# Altium schematic sheet ch32v003f4p6.SchDoc
size A
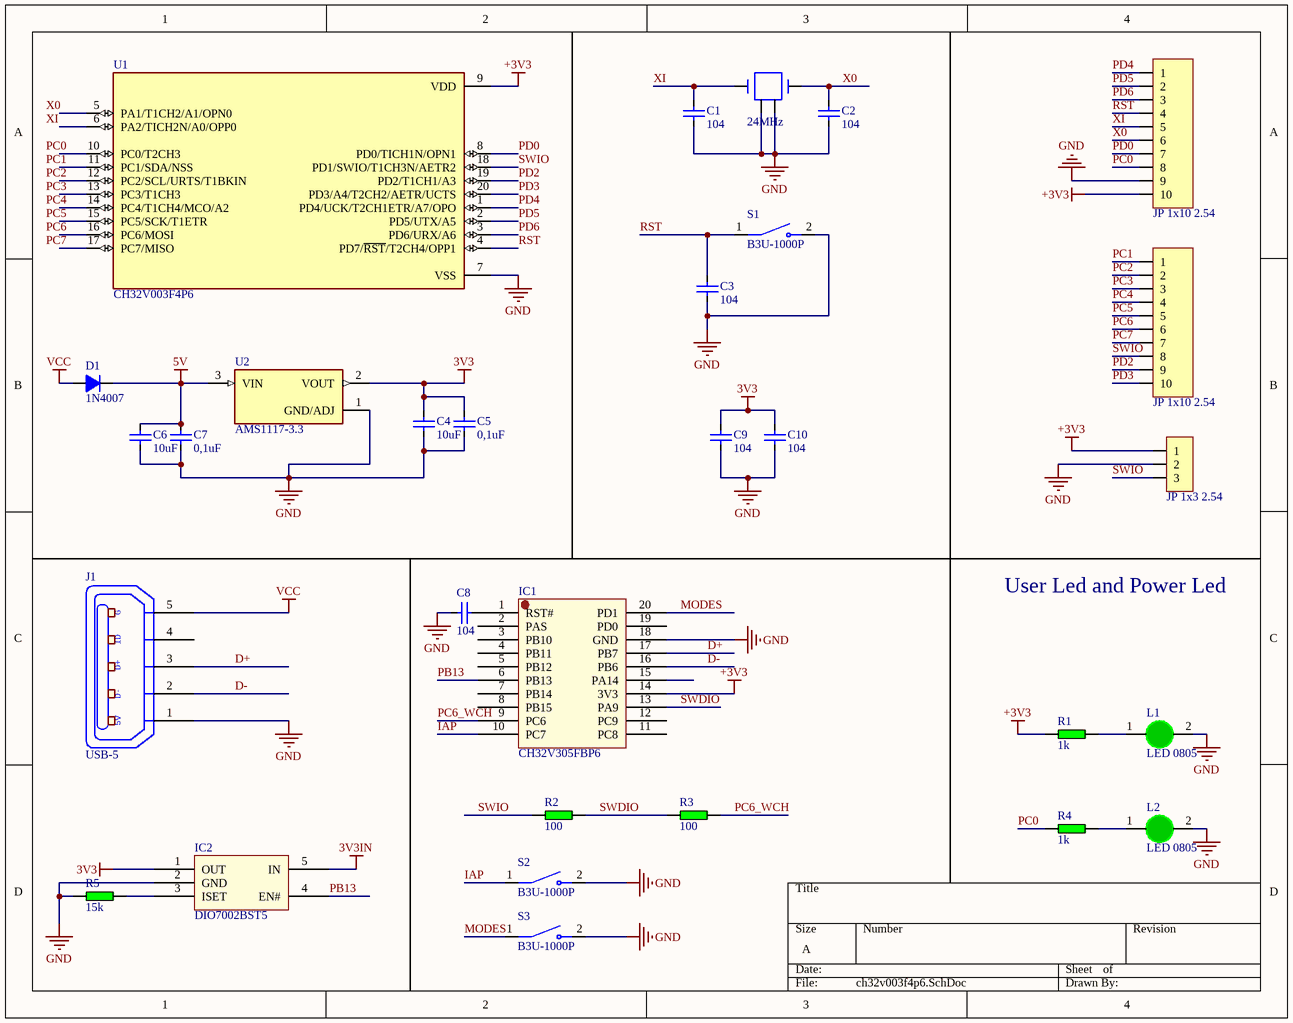
[diagram p0: ch32v003f4p6.SchDoc]

## Parts
C1  104  [CAP_0603]
C2  104  [CAP_0603]
C3  104  [CAP_0603]
C4  10uF  [CAP_0603]
C5  0,1uF  [CAP_0603]
C6  10uF  [CAP_0603]
C7  0,1uF  [CAP_0603]
C8  104  [CAP_0603]
C9  104  [CAP_0603]
C10  104  [CAP_0603]
D1  1N4007  [DIO-214AC(SMA)]
IC1  CH32V305FBP6  [TSSOP-20]
IC2  DIO7002BST5  [SOT23-5]
J1  USB-5  [USB-M1]
JP1  JP 1x10 2.54  [JP 1x10 DT]
JP2  JP 1x10 2.54  [JP 1x10 DT]
JP3  JP 1x3 2.54  [JP 1x3 DC]
L1  LED 0805  [LED-0805-Green]
L2  LED 0805  [LED-0805-Green]
R1  1k  [RES-SMD-0603]
R2  100  [RES-SMD-0603]
R3  100  [RES-SMD-0603]
R4  1k  [RES-SMD-0603]
R5  15k  [RES-SMD-0603]
S1  B3U-1000P  [SW_B3U-1000P]
S2  B3U-1000P  [SW_B3U-1000P]
S3  B3U-1000P  [SW_B3U-1000P]
U1  CH32V003F4P6  [SOP65P640X121-20N]
U2  AMS1117-3.3  [SOT229P700X180-4N]
Y1  24MHz  [Crystal 4 pin SMD 50x32]

## Nets
3V3: C4.2 C5.2 C9.2 C10.2 IC2.1(OUT) U2.2(VOUT)
3V3IN: IC2.5(IN)
5V: C6.2 C7.2 D1.2(K) U2.3(VIN)
+3V3: IC1.14(3V3) JP1.10 JP3.1 R1.2 U1.9(VDD)
GND: C1.1 C2.1 C3.1 C4.1 C5.1 C6.1 C7.1 C8.1 C9.1 C10.1 IC1.18(GND) IC2.2(GND) J1.1(P1) JP1.9 JP3.2 L1.2(K) L2.2(K) R5.2 S1.2 S2.2 S3.2 U1.7(VSS) U2.1(GND/ADJ) Y1.2(GND) Y1.4(GND)
VCC: D1.1(A) J1.5(P5)
D+: IC1.17(PB7) J1.3(P3)
D-: IC1.16(PB6) J1.2(P2)
IAP: IC1.10(PC7) S2.1
MODES: IC1.20(PD1) S3.1
PB13: IC1.6(PB13) IC2.4(EN#)
PC0: JP1.8 R4.2
PC1: JP2.1
PC2: JP2.2
PC3: JP2.3
PC4: JP2.4
PC5: JP2.5
PC6: JP2.6
PC6_WCH: IC1.9(PC6) R3.1
PC7: JP2.7
PD0: JP1.7 U1.8(PD0/TICH1N/OPN1)
PD2: JP2.9 U1.19(PD2/T1CH1/A3)
PD3: JP2.10 U1.20(PD3/A4/T2CH2/AETR/UCTS)
PD4: JP1.1 U1.1(PD4/UCK/T2CH1ETR/A7/OPO)
PD5: JP1.2 U1.2(PD5/UTX/A5)
PD6: JP1.3 U1.3(PD6/URX/A6)
RST: C3.2 JP1.4 S1.1 U1.4(PD7/~{RST}/T2CH4/OPP1)
SWDIO: IC1.13(PA9) R2.1 R3.2
SWIO: JP2.8 JP3.3 R2.2 U1.18(PD1/SWIO/T1CH3N/AETR2)
X0: C2.2 JP1.6 Y1.3(OSC2)
XI: C1.2 JP1.5 Y1.1(OSC1)
NetC8_2: C8.2 IC1.1(RST#)
NetIC2_3: IC2.3(ISET) R5.1
NetL1_1: L1.1(A) R1.1
NetL2_1: L2.1(A) R4.1

Not connected (* = marked no-connect by the designer): IC1 2(PAS) 3(PB10) 4(PB11) 5(PB12) 7(PB14) 8(PB15) 11(PC8) 12(PC9) 15(PA14) 19(PD0); J1 4(P4); U1 5(PA1/T1CH2/A1/OPN0) 6(PA2/TICH2N/A0/OPP0) 10(PC0/T2CH3) 11(PC1/SDA/NSS) 12(PC2/SCL/URTS/T1BKIN) 13(PC3/T1CH3) 14(PC4/T1CH4/MCO/A2) 15(PC5/SCK/T1ETR) 16(PC6/MOSI) 17(PC7/MISO)

## Notes on the sheet
- User Led and Power Led
- Labels drawn without touching a wire or pin: PC0, PC1, PC2, PC3, PC4, PC5, PC6, PC7, X0, XI
- (in symbol USB-5) G; ID; D+; D-; 5V

## Library data of the parts
C1-C10 = CapSMD: Capacitor; Value: 33p; Published: 8-Jun-2000; LatestRevisionDate: 17-Jul-2002; LatestRevisionNote: Re-released for DXP Platform.; PackageReference: RAD-0.3; Publisher: Altium Limited
D1 = D1A: Diode 1A; Value: 1N4007
IC2 = DIO7002BST5 SMD
J1 = USB-5: Manufacturer: FCI; Manufacturer Part Number: 10118193-0001LF; Connector Type: USB - micro B; Number of Contacts: 5; Gender: Receptacle; Specifications: USB 2.0; .Creator: MM; .Checked PCB: RF; Supplier 1: Digi-Key; RoHS: RoHS Compliant; Category: Connectors, Interconnects; Stock 1: 28642; Pricing 1: 1=0.46, 10=0.433, 25=0.3712, 50=0.3156, 100=0.3032, 250=0.27224, 500=0.25988 (USD); Packaging: Cut Tape (CT); Mounting Type: Surface Mount, Right Angle, Horizontal; Features: Shielded, Solder Retention; Ingress Protection: -; ComponentLink1URL: http://portal.fciconnect.com/Comergent//fci/drawing/10118193.pdf; ComponentLink1Description: http://portal.fciconnect.com/Comergent//fci/drawing/10118193.pdf; Supplier Part Number 1: 609-4616-1-ND; .Checked SCH: MM
JP1 JP2 = JP 1x10 2.54 Duc Thang: Cắm; Ten_Linh_Kien: Jump Đơn Đực 2.54MM 1x40P Thẳng 11MM; Don_Vi: Con; Ma_Hang: MH000903; Ghi_Chu: *; Kieu_Chan: *; Chung_Loai: Cắm
JP3 = JP 1x3 2.54 Duc Cong: Cắm; Ten_Linh_Kien: Jump Đơn Đực 2.54MM 1x40P Cong Đứng; Don_Vi: Con; Ma_Hang: MH000904; Ghi_Chu: *; Kieu_Chan: *; Chung_Loai: Cắm
L1 L2 = LED 0805 Xanh La: Dán; Don_Vi: Con; Ma_Hang: MH002326; Ten_Linh_Kien: LED 0805 Màu Xanh Lá (Green); Ghi_Chu: *; Kieu_Chan: *; Chung_Loai: Dán
R1-R5 = RES: Resistor 1/4W; Value: R1/4W - 1K
S1-S3 = B3U-1000P: Switch Tactile N.O. SPST Round Button Gull Wing 0.05A 12VDC 1.5N SMD Embossed T/R; Price: None; MP: B3U-1000P; Availability: Unavailable; Value: *; Package: None
U1 = CH32V003F4P6: Industrial-grade general-purpose microcontroller; MF: WCH; SnapEDA_Link: https://www.snapeda.com/parts/CH32V003F4P6/WCH/view-part/?ref=snap; Package: Package; Value: *; MP: CH32V003F4P6; Check_prices: https://www.snapeda.com/parts/CH32V003F4P6/WCH/view-part/?ref=eda
U2 = AMS1117-3.3: Sot223/Pkg 1-Amp 3.3-Volt Low Drop Out Voltage Regulatator; MF: Advanced Monolithic Systems; Package: SOT-223 Seeed Technology; Value: *; Check_prices: https://www.snapeda.com/parts/AMS1117-3.3/Advanced+Monolithic+Systems/view-part/?ref=eda; Price: None; Availability: Not in stock; MP: AMS1117-3.3; SnapEDA_Link: https://www.snapeda.com/parts/AMS1117-3.3/Advanced+Monolithic+Systems/view-part/?ref=snap
Y1 = XTAL_4Pin SMD: Crystal Oscillator; Published: 8-Jun-2000; LatestRevisionDate: 17-Jul-2002; LatestRevisionNote: Re-released for DXP Platform.; PackageReference: R38; Publisher: Altium Limited